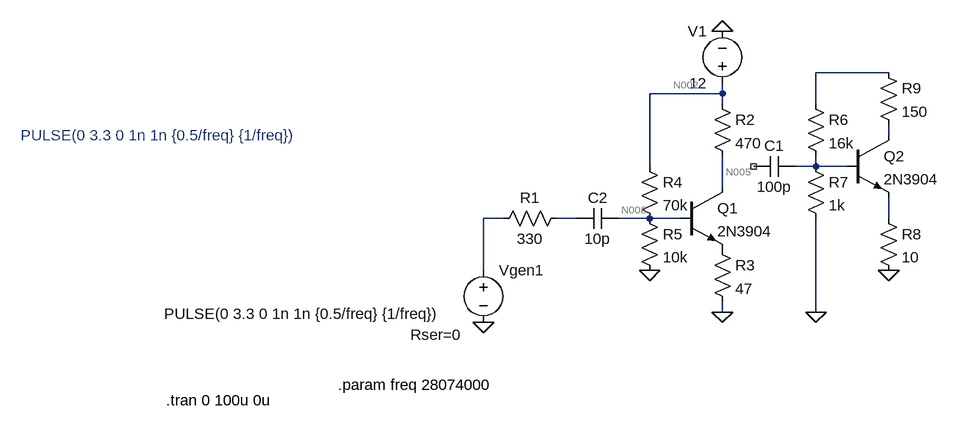
[diagram p0: schematic Draft5.asc]
Draft5.asc, the LTspice schematic file:
Version 4
SHEET 1 936 680
WIRE 848 -176 736 -176
WIRE 592 -144 592 -160
WIRE 592 -144 480 -144
WIRE 592 -128 592 -144
WIRE 736 -128 736 -176
WIRE 848 -80 848 -96
WIRE 480 -32 480 -144
WIRE 736 -32 736 -48
WIRE 736 -32 704 -32
WIRE 784 -32 736 -32
WIRE 592 0 592 -48
WIRE 256 48 224 48
WIRE 368 48 336 48
WIRE 480 48 432 48
WIRE 528 48 480 48
WIRE 848 48 848 16
WIRE 224 128 224 48
WIRE 592 192 592 176
WIRE 736 192 736 48
FLAG 224 208 0
FLAG 592 -240 0
FLAG 480 128 0
FLAG 592 192 0
FLAG 736 192 0
FLAG 848 128 0
SYMBOL voltage 224 112 R0
WINDOW 123 24 132 Left 0
WINDOW 39 -112 115 Left 2
WINDOW 3 -491 83 Left 2
SYMATTR SpiceLine Rser=0
SYMATTR Value PULSE(0 3.3 0 1n 1n {0.5/freq} {1/freq})
SYMATTR InstName Vgen1
SYMBOL res 352 32 R90
WINDOW 0 0 56 VBottom 2
WINDOW 3 32 56 VTop 2
SYMATTR InstName R1
SYMATTR Value 330
SYMBOL npn 528 0 R0
SYMATTR InstName Q1
SYMATTR Value 2N3904
SYMBOL res 576 -144 R0
SYMATTR InstName R2
SYMATTR Value 470
SYMBOL voltage 592 -144 R180
WINDOW 0 24 96 Left 2
WINDOW 3 24 16 Left 2
WINDOW 123 0 0 Left 0
WINDOW 39 0 0 Left 0
SYMATTR InstName V1
SYMATTR Value 12
SYMBOL npn 784 -80 R0
SYMATTR InstName Q2
SYMATTR Value 2N3904
SYMBOL cap 704 -48 R90
WINDOW 0 0 32 VBottom 2
WINDOW 3 32 32 VTop 2
SYMATTR InstName C1
SYMATTR Value 100p
SYMBOL res 720 -144 R0
SYMATTR InstName R6
SYMATTR Value 16k
SYMBOL res 720 -48 R0
SYMATTR InstName R7
SYMATTR Value 1k
SYMBOL res 832 32 R0
SYMATTR InstName R8
SYMATTR Value 10
SYMBOL res 832 -192 R0
SYMATTR InstName R9
SYMATTR Value 150
SYMBOL cap 432 32 R90
WINDOW 0 0 32 VBottom 2
WINDOW 3 32 32 VTop 2
SYMATTR InstName C2
SYMATTR Value 10p
SYMBOL res 576 80 R0
SYMATTR InstName R3
SYMATTR Value 47
SYMBOL res 464 -48 R0
SYMATTR InstName R4
SYMATTR Value 70k
SYMBOL res 464 32 R0
SYMATTR InstName R5
SYMATTR Value 10k
TEXT 0 304 Left 2 !.param freq 28074000
TEXT -264 328 Left 2 !.tran 0 100u 0u
TEXT -488 -80 Left 2 ;PULSE(0 3.3 0 1n 1n {0.5/freq} {1/freq})

The netlist it stands for:
* Draft5.asc
Vgen1 N006 0 PULSE(0 3.3 0 1n 1n {0.5/freq} {1/freq}) Rser=0
R1 N007 N006 330
Q1 N005 N008 P001 0 2N3904
R2 N002 N005 470
V1 N002 0 12
Q2 N003 N004 N009 0 2N3904
C1 N004 NC_01 100p
R6 N001 N004 16k
R7 N004 0 1k
R8 N009 0 10
R9 N001 N003 150
C2 N008 N007 10p
R3 P001 0 47
R4 N002 N008 70k
R5 N008 0 10k
.model NPN NPN
.model PNP PNP
.lib standard.bjt
.param freq 28074000
.tran 0 100u 0u
* PULSE(0 3.3 0 1n 1n {0.5/freq} {1/freq})
.backanno
.end

* Results of the author's LTspice run, read from the files saved beside the schematic
* Operating Point, zero values left out:
*   V(n005) = 7.114 V
*   V(n008) = 1.207 V
*   V(p001) = 490.2 mV
*   V(n002) = 12 V
*   Ic(Q1) = 10.4 mA
*   Ib(Q1) = 33.52 µA
*   Ie(Q1) = -10.43 mA
*   I(R2) = 10.4 mA
*   I(R3) = 10.43 mA
*   I(R4) = 154.2 µA
*   I(R5) = 120.7 µA
*   I(V1) = -10.55 mA